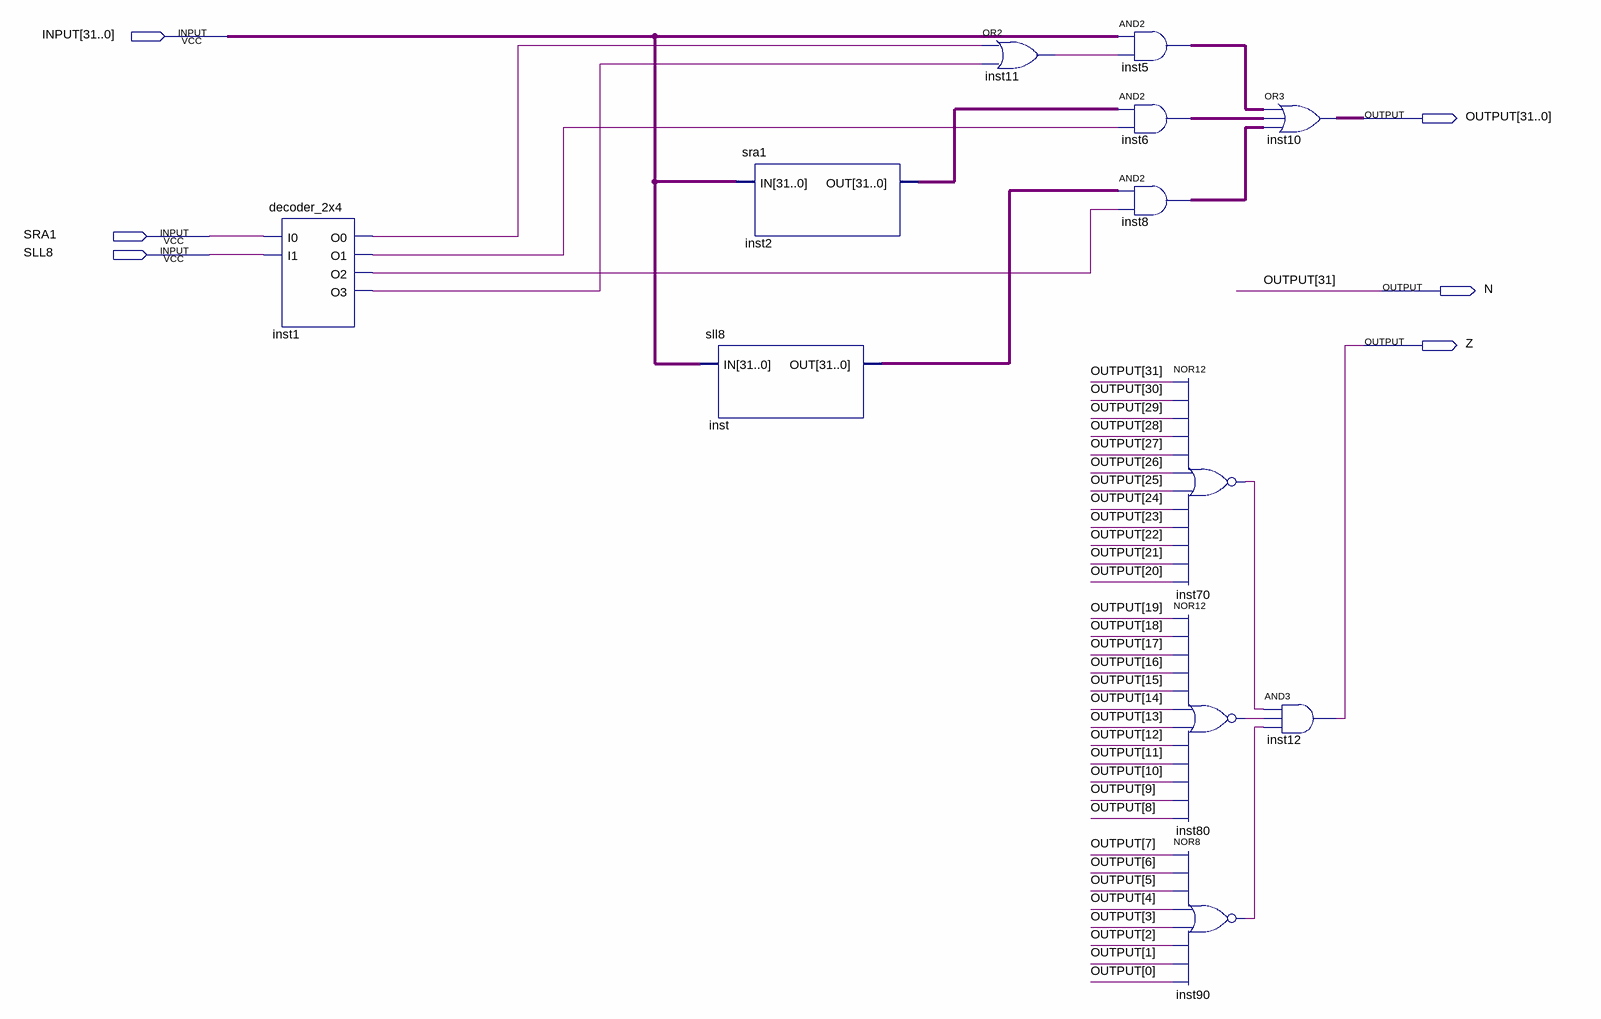
[diagram p0: schematic sheet]
// Quartus schematic shifter.bdf as structural Verilog: 12 symbols, 6 pins
module shifter (
  input  [31:0] INPUT,
  input  SRA1,
  input  SLL8,
  output [31:0] OUTPUT,
  output N,
  output Z
);

  wire inst1_o0, inst1_o1, inst1_o2, inst1_o3, inst11_out, inst70_out, inst80_out, inst90_out;
  wire [31:0] inst2_out, inst5_out, inst6_out, inst8_out, inst_out;

  decoder_2x4 inst1 (.I0(SRA1), .I1(SLL8), .O0(inst1_o0), .O1(inst1_o1), .O2(inst1_o2), .O3(inst1_o3));
  sll8 inst (.IN(INPUT), .OUT(inst_out));
  sra1 inst2 (.IN(INPUT), .OUT(inst2_out));
  or inst11 (inst11_out, inst1_o0, inst1_o3);
  assign inst5_out = INPUT & {32{inst11_out}};  // AND2 inst5, 32 bits wide
  assign inst6_out = inst2_out & {32{inst1_o1}};  // AND2 inst6, 32 bits wide
  assign inst8_out = inst_out & {32{inst1_o2}};  // AND2 inst8, 32 bits wide
  nor inst70 (inst70_out, N, OUTPUT[30], OUTPUT[29], OUTPUT[28], OUTPUT[27], OUTPUT[26], OUTPUT[25], OUTPUT[24], OUTPUT[23], OUTPUT[22], OUTPUT[21], OUTPUT[20]);
  nor inst80 (inst80_out, OUTPUT[19], OUTPUT[18], OUTPUT[17], OUTPUT[16], OUTPUT[15], OUTPUT[14], OUTPUT[13], OUTPUT[12], OUTPUT[11], OUTPUT[10], OUTPUT[9], OUTPUT[8]);
  nor inst90 (inst90_out, OUTPUT[7], OUTPUT[6], OUTPUT[5], OUTPUT[4], OUTPUT[3], OUTPUT[2], OUTPUT[1], OUTPUT[0]);
  assign {N, OUTPUT[30:0]} = inst5_out | inst6_out | inst8_out;  // OR3 inst10, 32 bits wide
  and inst12 (Z, inst70_out, inst80_out, inst90_out);

  assign OUTPUT[31] = N;
endmodule
